# EAGLE design pcb_univ_3-(1-3-5)-x-x-rev4 (EAGLE 5.11)
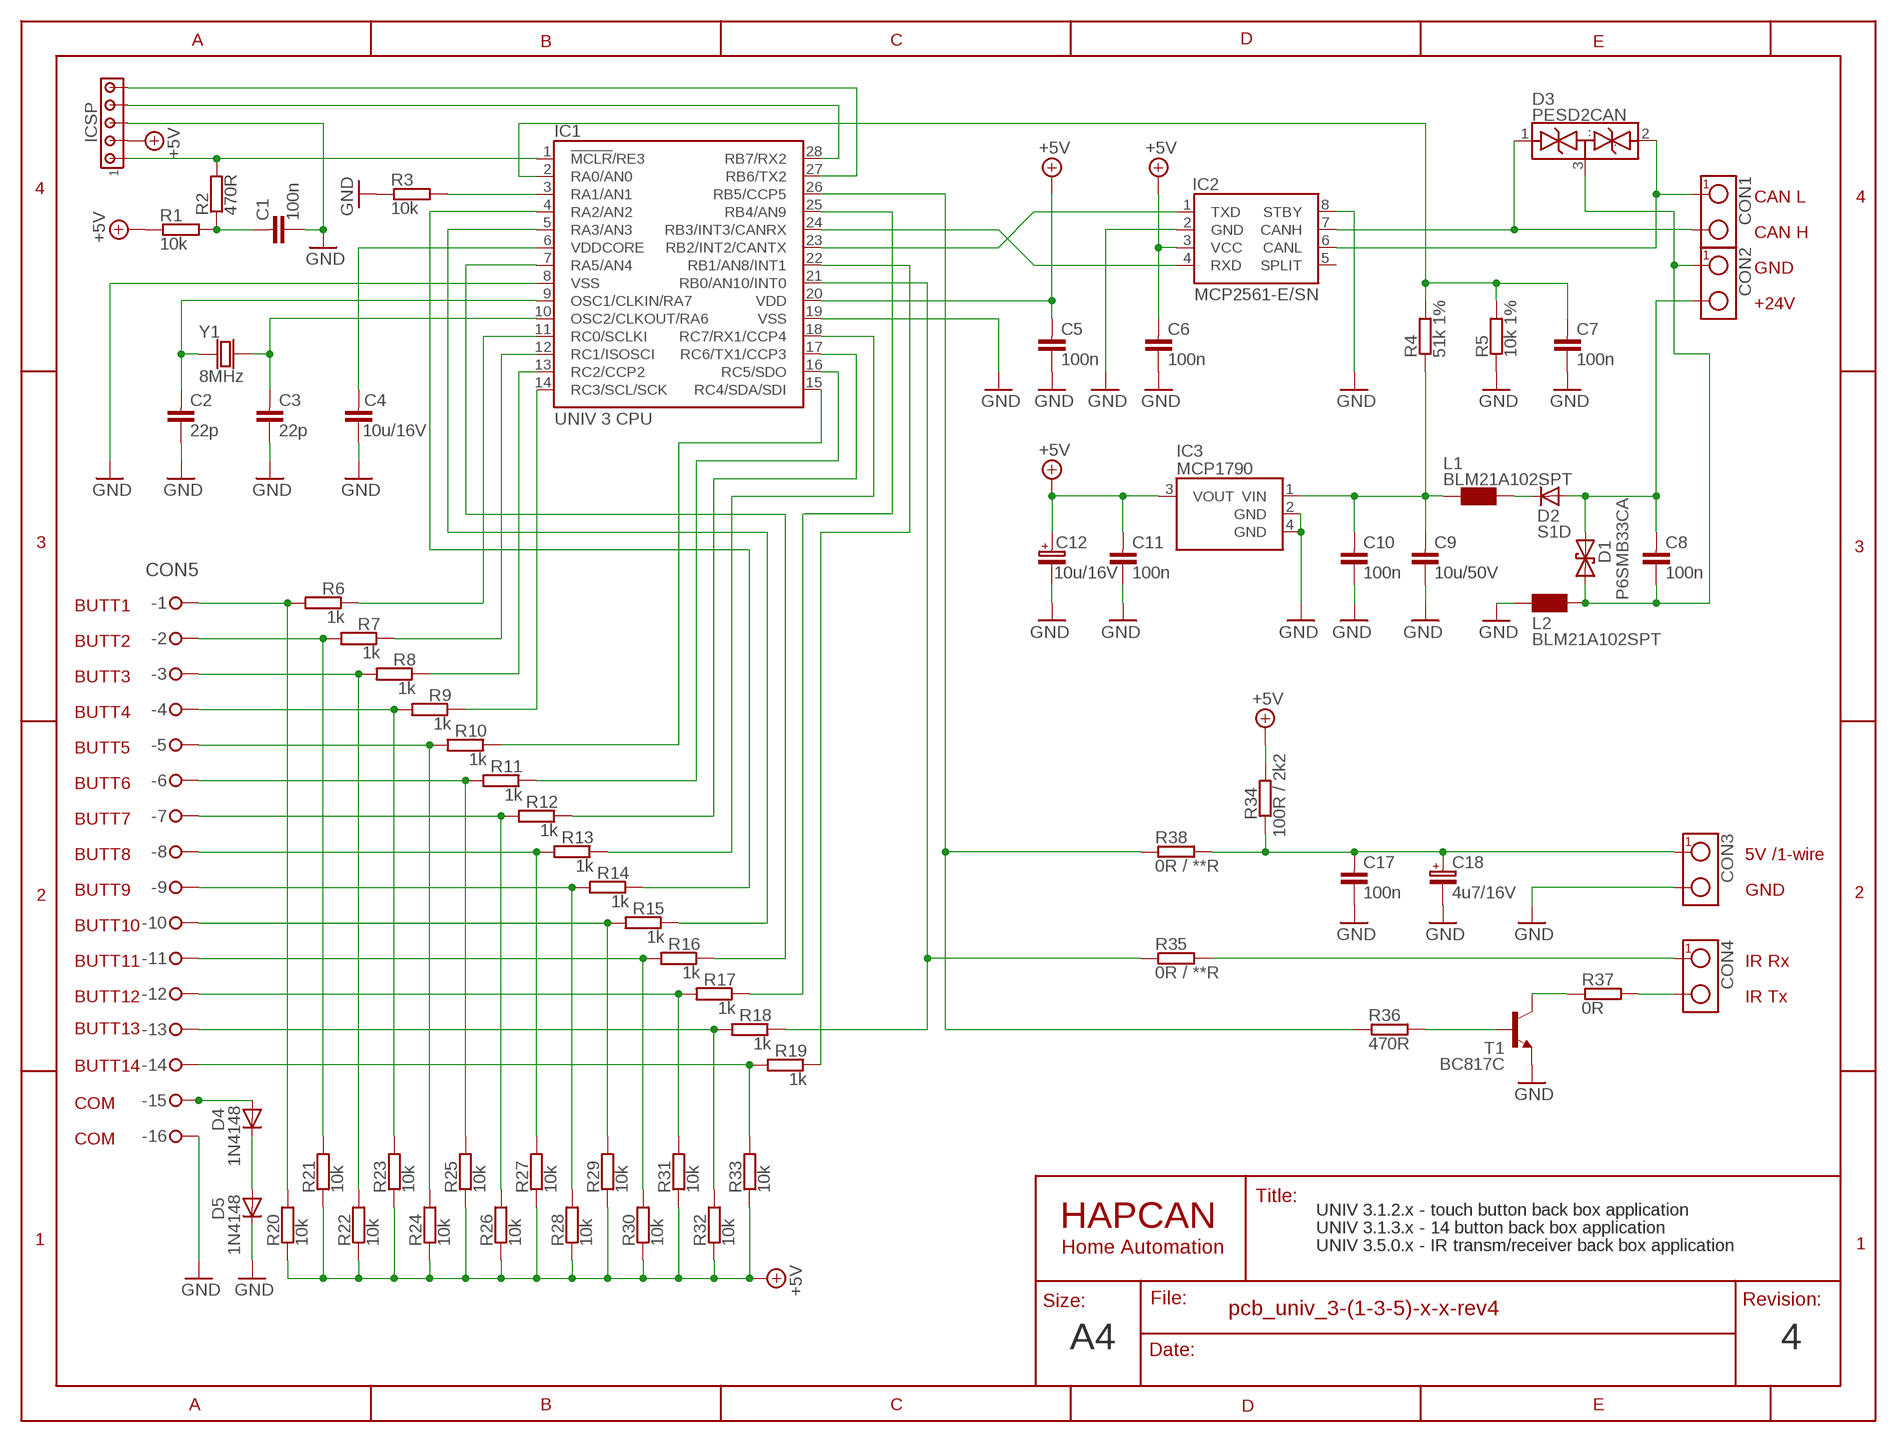
[diagram p0: schematic, sheet 1]

## Parts
-  CONNECTOR-16PIN  [CONNECTOR-16PIN]
C1  100n  CAPACITOR0805  [0805]
C2  22p  CAPACITOR0805  [0805]
C3  22p  CAPACITOR0805  [0805]
C4  10u/16V  CAPACITOR0805  [0805]
C5  100n  CAPACITOR0805  [0805]
C6  100n  CAPACITOR0805  [0805]
C7  100n  CAPACITOR0805  [0805]
C8  100n  CAPACITOR0805  [0805]
C9  10u/50V  CAPACITOR1210  [1210]
C10  100n  CAPACITOR0805  [0805]
C11  100n  CAPACITOR0805  [0805]
C12  10u/16V  CAPACITOR-POLARIZED-SMC_B  [SMC_B]
C17  100n  CAPACITOR0805  [0805]
C18  4u7/16V  CAPACITOR-POLARIZED-SMC_B  [SMC_B]
CON1  TERMINAL-2  TERMINAL-2-5X9MM  [ARK2-5X9MM]
CON2  TERMINAL-2  TERMINAL-2-5X9MM  [ARK2-5X9MM]
CON3  TERMINAL-2  TERMINAL-2-5X9MM  [ARK2-5X9MM]
CON4  TERMINAL-2  TERMINAL-2-5X9MM  [ARK2-5X9MM]
D1  P6SMB33CA  DIODE_TRANSIL2  [DO-214_TRANSIL2]
D2  S1D  DIODE_DO-214  [DO-214]
D3  PESD2CAN  PESD2CANSOT-23  [SOT-23]
D4  1N4148  DIODE_0805  [0805]
D5  1N4148  DIODE_0805  [0805]
IC1  UNIV 3 CPU  UNIV3CPU-I/SO  [UNIV3CPU]
IC2  MCP2561-E/SN  [SO-08]
IC3  MCP1790  [SOT-223]
ICSP  HEADER5  [SIP-5]
L1  BLM21A102SPT  BLMXXX  [0805@1]
L2  BLM21A102SPT  BLMXXX  [0805@1]
R1  10k  RESISTOR0805  [0805]
R2  470R  RESISTOR0805  [0805]
R3  10k  RESISTOR0805  [0805]
R4  51k 1%  RESISTOR0805  [0805]
R5  10k 1%  RESISTOR0805  [0805]
R6  1k  RESISTOR0805  [0805]
R7  1k  RESISTOR0805  [0805]
R8  1k  RESISTOR0805  [0805]
R9  1k  RESISTOR0805  [0805]
R10  1k  RESISTOR0805  [0805]
R11  1k  RESISTOR0805  [0805]
R12  1k  RESISTOR0805  [0805]
R13  1k  RESISTOR0805  [0805]
R14  1k  RESISTOR0805  [0805]
R15  1k  RESISTOR0805  [0805]
R16  1k  RESISTOR0805  [0805]
R17  1k  RESISTOR0805  [0805]
R18  1k  RESISTOR0805  [0805]
R19  1k  RESISTOR0805  [0805]
R20  10k  RESISTOR0805  [0805]
R21  10k  RESISTOR0805  [0805]
R22  10k  RESISTOR0805  [0805]
R23  10k  RESISTOR0805  [0805]
R24  10k  RESISTOR0805  [0805]
R25  10k  RESISTOR0805  [0805]
R26  10k  RESISTOR0805  [0805]
R27  10k  RESISTOR0805  [0805]
R28  10k  RESISTOR0805  [0805]
R29  10k  RESISTOR0805  [0805]
R30  10k  RESISTOR0805  [0805]
R31  10k  RESISTOR0805  [0805]
R32  10k  RESISTOR0805  [0805]
R33  10k  RESISTOR0805  [0805]
R34  100R / 2k2  RESISTOR0805  [0805]
R35  0R / **R  RESISTOR0805  [0805]
R36  470R  RESISTOR0805  [0805]
R37  0R  RESISTOR0805  [0805]
R38  0R / **R  RESISTOR0805  [0805]
T1  BC817C  TRANSISTOR-NPN  [SOT-23]
Y1  8MHz  CRYSTAL-HC49V  [CRYSTAL-HC49V]

## Nets
+5V: C5.1 C6.1 C11.1 C12.+ IC1.20(VDD) IC2.3(VCC) IC3.3(VOUT) ICSP.2 R1.1 R20.1 R21.1 R22.1 R23.1 R24.1 R25.1 R26.1 R27.1 R28.1 R29.1 R30.1 R31.1 R32.1 R33.1 R34.1
GND: -.16 C1.2 C2.2 C3.2 C4.2 C5.2 C6.2 C7.2 C9.2 C10.2 C11.2 C12.- C17.2 C18.- CON3.2 D5.1(C) IC1.8(VSS) IC1.19(VSS) IC2.2(GND) IC2.8(STBY) IC3.2(GND) IC3.4(GND) ICSP.3 L2.1 R3.1 R5.1 T1.2(E)
N$1: IC1.26(RB5/CCP5) R36.1 R38.1
N$2: IC1.24(RB3/INT3/CANRX) IC2.4(RXD)
N$3: IC1.23(RB2/INT2/CANTX) IC2.1(TXD)
N$4: CON4.2 R37.2
N$5: -.1 R6.2 R20.2
N$6: -.3 R8.2 R22.2
N$7: C1.1 R1.2 R2.1
N$8: IC1.1(!MCLR!/RE3) ICSP.1 R2.2
N$9: CON1.2 D3.1(.) IC2.7(CANH)
N$10: IC1.28(RB7/RX2) ICSP.4
N$11: IC1.22(RB1/AN8/INT1) R19.1
N$12: IC1.3(RA1/AN1) R3.2
N$13: -.9 R14.2 R28.2
N$14: IC1.27(RB6/TX2) ICSP.5
N$15: C3.1 IC1.10(OSC2/CLKOUT/RA6) Y1.2
N$16: C7.1 IC1.2(RA0/AN0) R4.2 R5.2
N$17: C9.1 C10.1 IC3.1(VIN) L1.1 R4.1
N$18: IC1.21(RB0/AN10/INT0) R18.1 R35.1
N$19: -.2 R7.2 R21.2
N$20: IC1.25(RB4/AN9) R17.1
N$21: -.4 R9.2 R23.2
N$22: IC1.14(RC3/SCL/SCK) R9.1
N$23: -.6 R11.2 R25.2
N$24: -.7 R12.2 R26.2
N$25: IC1.11(RC0/SCLKI) R6.1
N$26: IC1.12(RC1/ISOSCI) R7.1
N$27: IC1.13(RC2/CCP2) R8.1
N$28: -.10 R15.2 R29.2
N$29: IC1.15(RC4/SDA/SDI) R10.1
N$30: IC1.7(RA5/AN4) R16.1
N$31: -.5 R10.2 R24.2
N$32: -.8 R13.2 R27.2
N$33: IC1.5(RA3/AN3) R15.1
N$34: IC1.4(RA2/AN2) R14.1
N$35: R37.1 T1.3(C)
N$36: -.11 R16.2 R30.2
N$37: C17.1 C18.+ CON3.1 R34.2 R38.2
N$38: -.12 R17.2 R31.2
N$39: C8.2 CON2.1 D1.C D3.3(...) L2.2
N$40: C2.1 IC1.9(OSC1/CLKIN/RA7) Y1.1
N$41: -.14 R19.2 R33.2
N$42: CON1.1 D3.2(..) IC2.6(CANL)
N$43: R36.2 T1.1(B)
N$44: CON4.1 R35.2
N$45: IC1.16(RC5/SDO) R11.1
N$46: IC1.17(RC6/TX1/CCP3) R12.1
N$47: IC1.18(RC7/RX1/CCP4) R13.1
N$48: -.13 R18.2 R32.2
N$49: -.15 D4.2(A)
N$50: D4.1(C) D5.2(A)
N$56: C4.1 IC1.6(VDDCORE)
N$64: C8.1 CON2.2 D1.A D2.A
N$67: D2.C L1.2
Unconnected: IC2.5(SPLIT)

## Notes on the sheet
- CAN L
- CAN H
- GND
- +24V
- CON5
- BUTT1
- BUTT2
- BUTT3
- BUTT4
- BUTT5
- BUTT6
- BUTT7
- BUTT8 | 5V | /1-wire
- BUTT9 | GND
- BUTT10
- BUTT11 | IR Rx
- BUTT12 | IR Tx
- BUTT13
- BUTT14
- COM
- COM
- UNIV 3.1.2.x - touch button back box application
- UNIV 3.1.3.x - 14 button back box application
- UNIV 3.5.0.x - IR transm/receiver back box application
- A4 | 4

## Library data of the parts
- = HAPCAN_devices - UNIV3:CONNECTOR-16PIN: 16pin connector 2.54 raster
C1-C11 C17 = HAPCAN_devices - UNIV3:CAPACITOR: HAPCAN Capacitor
C12 C18 = HAPCAN_devices - UNIV3:CAPACITOR-POLARIZED: HAPCAN Polarazied Capacitor
CON1-CON4 = HAPCAN_devices - UNIV3:TERMINAL-2: HAPCAN Terminal Block - 2 way
D1 = HAPCAN_devices - UNIV3:DIODE_TRANSIL2: HAPCAN Bidirectional transil diode
D2 D4 D5 = HAPCAN_devices - UNIV3:DIODE: HAPCAN Rectifier Diode
D3 = HAPCAN_devices - UNIV3:PESD2CAN: CAN bus ESD protection diode
IC1 = HAPCAN_devices - UNIV3:UNIV3CPU: HAPCAN Microcontroller UNIV 3 CPU
IC2 = HAPCAN_devices - UNIV3:MCP2561: HAPCAN CAN Tranceiver
IC3 = HAPCAN_devices - UNIV3:MCP1790: 70 mA, High Voltage Regulator
ICSP = HAPCAN_devices - UNIV3:HEADER5: HAPCAN Header 5
L1 L2 = HAPCAN_devices - UNIV3:BLMXXX: Choke
R1-R38 = HAPCAN_devices - UNIV3:RESISTOR: HAPCAN Resistor
T1 = HAPCAN_devices - UNIV3:TRANSISTOR-NPN: HAPCAN NPN Transistor
Y1 = HAPCAN_devices - UNIV3:CRYSTAL: HAPCAN Crystal

## Board
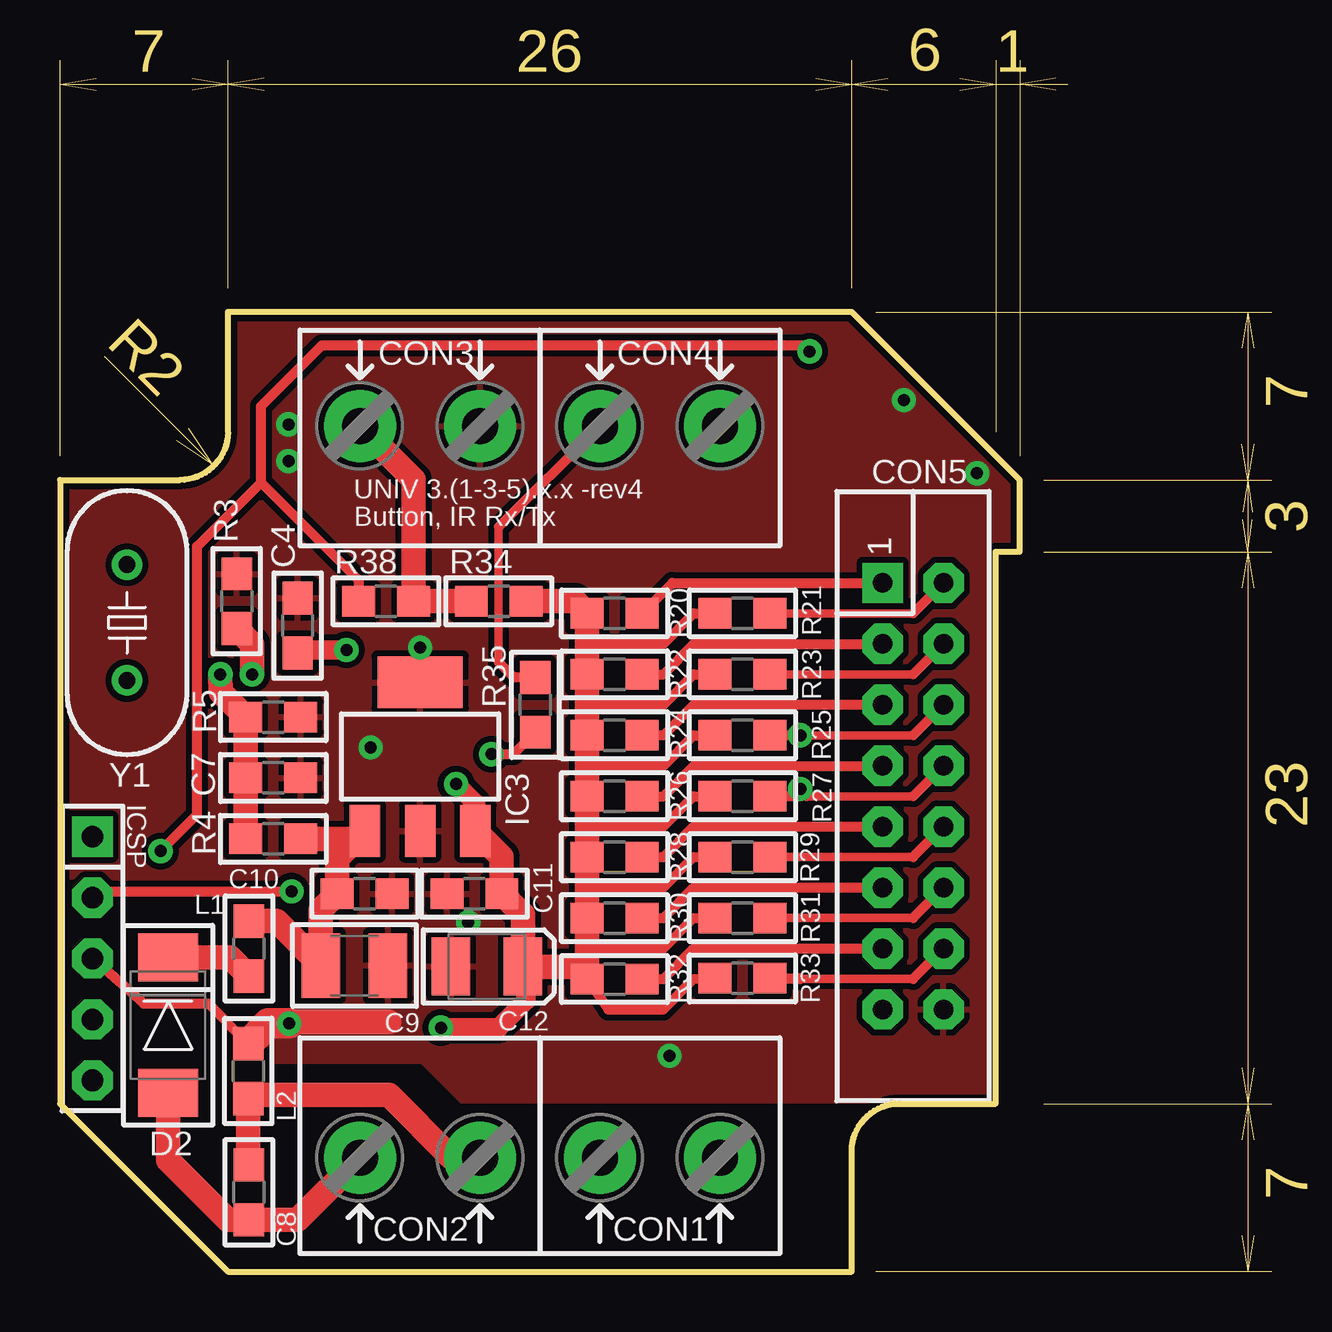
[diagram p1: board, top side]
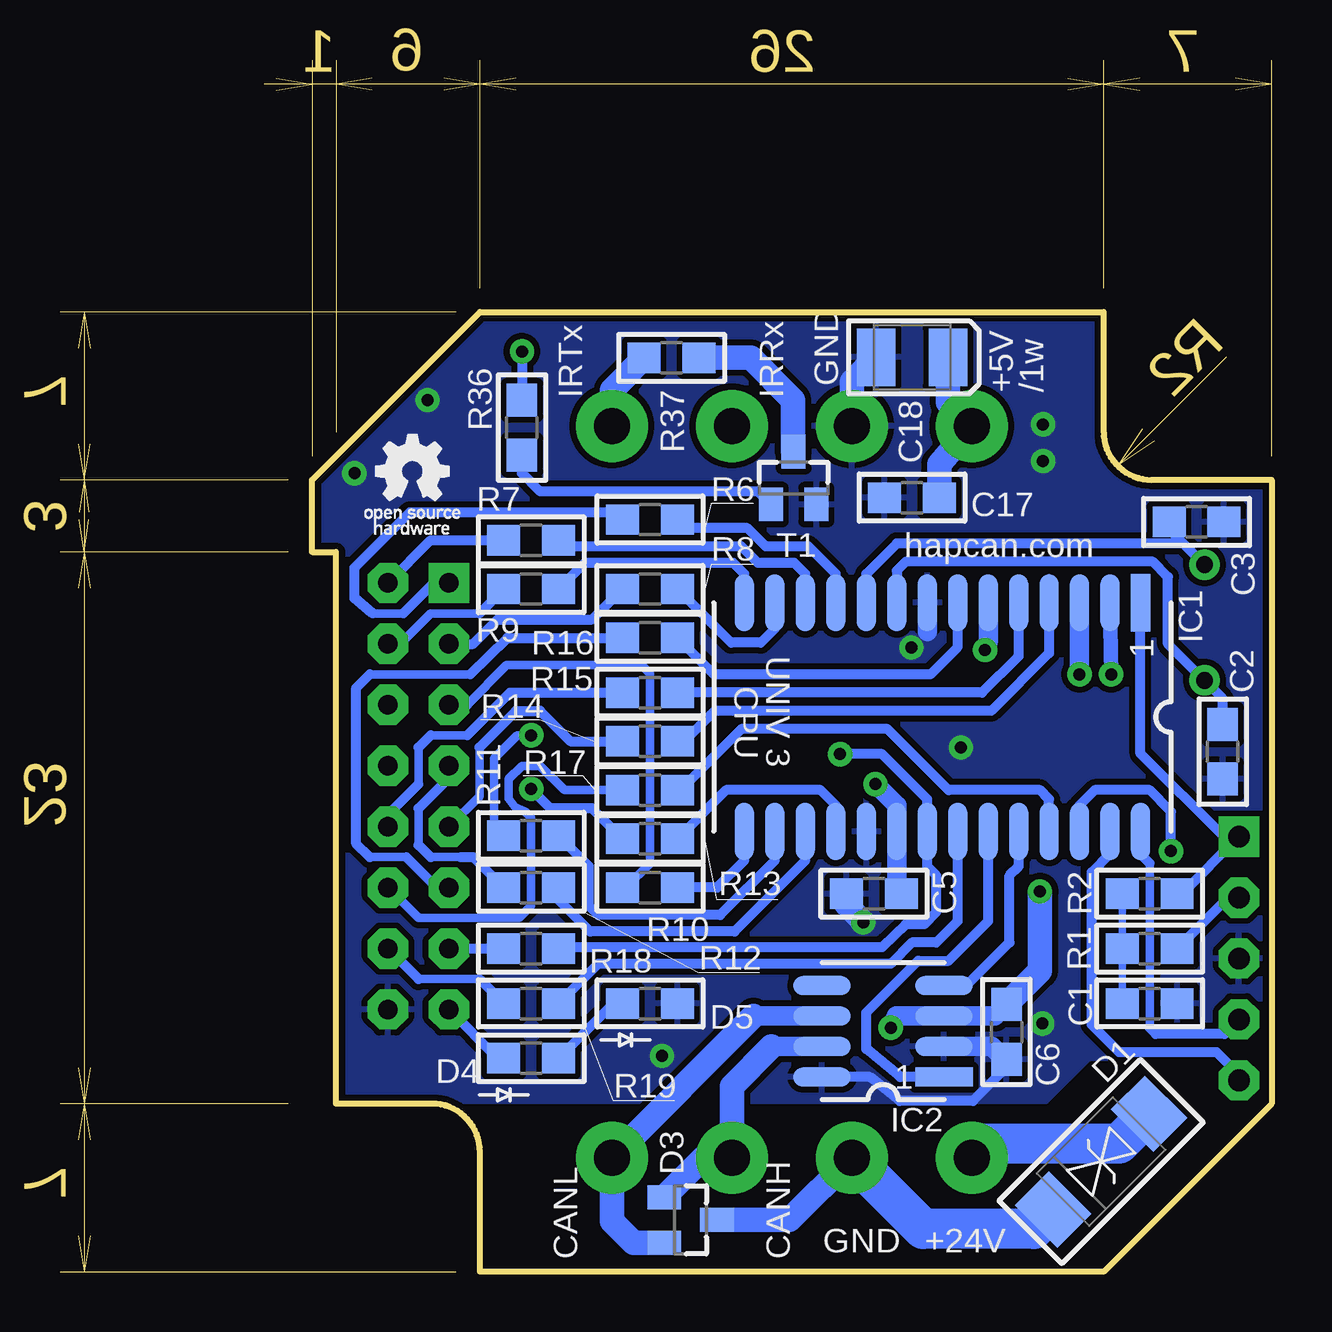
[diagram p2: board, bottom side, seen from below]

Size 50.5 x 50.5 mm. Coordinates in mm from the lower left corner, seen from the top.
Outline: 6.37,33.63 1.86,38.13
Outline: 6.37,33.63 4.87,34.63
Outline: 6.37,33.63 5.37,35.13
Outline: 0,34 0,49.5
Outline: 0,49.5 0,50.5
Outline: 0,49.5 39,49.5
Outline: 39,49.5 40,49.5
Outline: 40,50.5 40,49.5
Outline: 40,49.5 40,34
Outline: 33,41 33,50.5
Outline: 7,41 7,50.5
Outline: 0,49.5 1.5,49.75
Outline: 0,49.5 1.5,49.25
Outline: 8.5,49.75 5.5,49.25
Outline: 5.5,49.75 8.5,49.25
Outline: 31.5,49.25 34.5,49.75
Outline: 31.5,49.75 34.5,49.25
Outline: 34,40 49.5,40
Outline: 49.5,40 50.5,40
Outline: 49.5,40 49.5,33
Outline: 49.5,33 49.5,30
Outline: 49.5,30 49.5,0
Outline: 50.5,0 49.5,0
Outline: 49.5,0 34,0
Outline: 41,7 50.5,7
Outline: 41,33 49.5,33
Outline: 49.5,33 50.5,33
Outline: 49.5,40 49.75,38.5
Outline: 49.5,40 49.25,38.5
Outline: 49.5,33 49.25,34.5
Outline: 49.75,34.5 49.5,33
Outline: 49.25,8.5 49.75,5.5
Outline: 49.75,8.5 49.25,5.5
Outline: 49.25,1.5 49.5,0
Outline: 49.75,1.5 49.5,0
Outline: 41,30 49.5,30
Outline: 49.5,30 50.5,30
Outline: 49.5,30 49.75,28.5
Outline: 49.5,30 49.25,28.5
Outline: 49.5,33 49.3,31.65
Outline: 49.5,33 49.7,31.65
Outline: 49.5,30 49.7,31.35
Outline: 49.5,30 49.3,31.35
Outline: 39,50.5 39,49.5
Outline: 39,49.5 39,35
Outline: 37.5,49.75 39,49.5
Outline: 37.5,49.25 39,49.5
Outline: 40,49.5 42,49.5
Outline: 41.5,49.75 40,49.5
Outline: 41.5,49.25 40,49.5
Outline: 40,30 40,33 33,40 7,40 7,35 arc-90 5,33 0,33 0,7 7,0 33,0 33,5 arc-90 35,7 39,7 39,30 40,30
Copper layers (1*16): Top 0.035mm / dielectric 1.5mm / Bottom 0.035mm
Design rules "hapcan_drc *": minimum track width 10mil, minimum drill 0.5mm, track to track 10mil, track to pad 10mil, pad to pad 10mil, via to via 10mil, smd to smd 0mil, copper to edge 10mil, drill to drill 8mil, minimum pad ring 10mil, minimum via ring 10mil, stop-mask expansion 4mil, vias tented up to drill 0mil, thermal gap 10mil

### Footprints (pad centres in the part's own frame; a part is rotated, then mirrored left to right if it is on the bottom)
CONNECTOR-16PIN = drill 0.813 pad 1.676 square: 1 -8.89,-1.27 | drill 0.813 pad 1.676 octagon: 2 -8.89,1.27; 3 -6.35,-1.27; 4 -6.35,1.27; 5 -3.81,-1.27; 6 -3.81,1.27; 7 -1.27,-1.27; 8 -1.27,1.27; 9 1.27,-1.27; 10 1.27,1.27; 11 3.81,-1.27; 12 3.81,1.27; 13 6.35,-1.27; 14 6.35,1.27; 15 8.89,-1.27; 16 8.89,1.27
0805 = smd 1.372 x 1.27: 1 -1.143,0; 2 1.143,0
1210 = smd 1.6 x 2.7: 1 -1.4,0; 2 1.4,0
SMC_B = smd 1.6 x 2.4: + -1.5,0; - 1.5,0
ARK2-5X9MM = drill 1.5 pad 3 round: 1 -2.5,0; 2 2.5,0
DO-214_TRANSIL2 = smd 2 x 2.5: A 2.82,0; C -2.82,0
DO-214 = smd 2 x 2.5: A 2.82,0; C -2.82,0
SOT-23 = smd 1 x 1.4: 1 -0.95,-1.1; 2 0.95,-1.1; 3 0,1.1
UNIV3CPU = smd 2.4 x 0.8: 1 -4.763,8.255; 2 -4.763,6.985; 3 -4.763,5.715; 4 -4.763,4.445; 5 -4.763,3.175; 6 -4.763,1.905; 7 -4.763,0.635; 8 -4.763,-0.635; 9 -4.763,-1.905; 10 -4.763,-3.175; 11 -4.763,-4.445; 12 -4.763,-5.715; 13 -4.763,-6.985; 14 -4.763,-8.255; 15 4.763,-8.255; 16 4.763,-6.985; 17 4.763,-5.715; 18 4.763,-4.445; 19 4.763,-3.175; 20 4.763,-1.905; 21 4.763,-0.635; 22 4.763,0.635; 23 4.763,1.905; 24 4.763,3.175; 25 4.763,4.445; 26 4.763,5.715; 27 4.763,6.985; 28 4.763,8.255
SO-08 = smd 2.4 x 0.8: 1 -2.54,1.905; 2 -2.54,0.635; 3 -2.54,-0.635; 4 -2.54,-1.905; 5 2.54,-1.905; 6 2.54,-0.635; 7 2.54,0.635; 8 2.54,1.905
SOT-223 = smd 1.27 x 2.159: 1 -2.311,-3.099; 2 0,-3.099; 3 2.311,-3.099 | smd 3.556 x 2.159: 4 0,3.099
SIP-5 = drill 0.9 pad 1.676 square: 1 -5.08,0 | drill 0.9 pad 1.676 octagon: 2 -2.54,0; 3 0,0; 4 2.54,0; 5 5.08,0
0805@1 = smd 1.397 x 1.27: 1 -1.143,0; 2 1.143,0
CRYSTAL-HC49V = drill 0.7 pad 1.27 round: 1 -2.413,0; 2 2.413,0

### Placement (x,y rotation side)
-  35.56,19.81 270 top
C1  5.08,11.18 0 bottom
C2  2.03,21.67 270 bottom
C3  3.12,31.24 0 bottom
C4  9.91,26.92 90 top
C5  16.57,15.75 180 bottom
C6  11.05,9.98 270 bottom
C7  8.89,20.57 0 top
C8  7.87,3.3 90 top
C9  12.27,12.75 0 top
C10  12.7,15.75 0 top
C11  17.27,15.75 180 top
C12  17.79,12.72 180 top
C17  14.99,32.26 180 bottom
C18  14.98,38.11 180 bottom
CON1  25,4.75 180 top
CON2  15,4.75 180 top
CON3  15,35.25 0 top
CON4  25,35.25 0 top
D1  7.1,4.58 45 bottom
D2  4.51,10.27 270 top
D3  24.22,2.15 270 bottom
D4  30.86,8.89 180 bottom
D5  25.91,11.18 180 bottom
IC1  13.72,23.11 270 bottom
IC2  16.19,10.01 180 bottom
IC3  15.01,21.46 0 top
ICSP  1.36,13.05 270 top
L1  7.87,13.46 270 top
L2  7.85,8.36 270 top
R1  5.08,13.46 180 bottom
R2  5.08,15.75 0 bottom
R3  7.37,27.94 270 top
R4  8.89,18.03 180 top
R5  8.89,23.11 180 top
R6  25.91,31.34 180 bottom
R7  30.86,30.48 180 bottom
R8  25.91,28.45 180 bottom
R9  30.86,28.45 180 bottom
R10  25.91,16 180 bottom
R11  30.86,18.16 180 bottom
R12  30.86,16 180 bottom
R13  25.91,18.03 180 bottom
R14  25.91,22.1 180 bottom
R15  25.91,24.13 180 bottom
R16  25.91,26.42 180 bottom
R17  25.91,20.07 180 bottom
R18  30.86,13.46 180 bottom
R19  30.86,11.18 180 bottom
R20  23.11,27.43 0 top
R21  28.45,27.43 0 top
R22  23.11,24.89 0 top
R23  28.45,24.89 0 top
R24  23.11,22.35 0 top
R25  28.45,22.35 0 top
R26  23.11,19.81 0 top
R27  28.45,19.81 0 top
R28  23.11,17.27 0 top
R29  28.45,17.27 0 top
R30  23.11,14.73 0 top
R31  28.45,14.73 0 top
R32  23.11,12.19 0 top
R33  28.45,12.22 0 top
R34  18.29,27.94 180 top
R35  19.81,23.62 90 top
R36  31.24,35.18 270 bottom
R37  25.01,38.08 180 bottom
R38  13.59,27.94 0 top
T1  19.92,33.08 0 bottom
Y1  2.79,27.05 90 top

### Tracks (layer width: path | path; a pad name or v marks a point on that pad's centre or on a via)
+5V  (via drill 0.5, 0.5 pad 1.02)
  Top 0.406: R21.1 26.42,27.43 25.15,26.16 21.97,26.16 | R23.1 26.42,24.89 25.15,23.62 21.97,23.62 | R25.1 26.42,22.35 25.15,21.08 21.97,21.08 | R27.1 26.42,19.81 25.15,18.54 21.97,18.54 | R29.1 26.42,17.27 25.15,16 21.97,16 | R31.1 26.42,14.73 25.15,13.46 21.97,13.46 | R33.1 26.42,12.19 25.15,10.92 22.86,10.92 R32.1 | 9.49,15.84 v9.65,15.85 1.62,15.85 ICSP.2
  Top 0.813: v15.88,10.16 18.29,10.16 19.43,11.3 19.43,12.7 C12.+ | IC3.3 17.32,19.51 v16.51,20.32
  Top 1.016: C12.+ 19.29,14.89 C11.1 18.41,17.27 IC3.3 | R34.1 21.46,27.94 R20.1 21.97,26.16 R22.1 21.97,23.62 R24.1 21.97,21.08 R26.1 21.97,18.54 R28.1 21.97,16 R30.1 21.97,13.46 R32.1 21.97,12.7 19.43,12.7
  Bottom 0.406: 15.62,15.74 C5.1 | R1.1 1.81,15.59 ICSP.2
  Bottom 0.813: 15.62,15.74 IC1.20 15.62,19.43 v16.51,20.32 | v15.88,10.16 15.64,10.65 IC2.3 11.53,10.65 C6.1
  Bottom 1.016: C6.1 9.65,12.52 v9.65,15.85
GND  (via drill 0.5, 0.5 pad 0.81, 0.5 pad 1.02)
  Top 0.406: ICSP.3 3.48,11.18 6.17,11.18 L2.1
  Top 1.016: C12.- 16.36,12.75 | v15.01,26.01 | v9.55,10.34 9.91,10.41 13.72,10.41
  Top 1.27: L2.1 8.69,10.34 v9.55,10.34
  Bottom 0.406: IC1.19 16.89,19.18 | IC2.8 16.75,8.11 15.49,7.11 12.45,7.11 10.92,8.64
  Bottom 0.813: IC1.8 14.35,26.67 | 10.92,8.64 11.66,9.38 IC2.2
  Bottom 1.016: CON3.2 17.5,37.09 C18.- | v17.02,14.55 17.71,15.3 C5.2
  other vias: 9.53,35.31 9.53,33.78 12.95,21.84 25.4,8.99 38.23,33.27 35.18,36.32
  pour Top (isolate 0.254): 7,40 33,40 40,33 40,30 39,30 39,7.11 16.76,7.11 15.11,8.76 8.41,8.76 8.43,10 10,11.02 10.08,15 0,15.21 0,33 6,33 7,34
  pour Bottom: 7,40 33,40 40,33 40,30 39,30 39,8 39.01,7.11 9.4,7.11 7.62,8.89 0,9.02 0,33 6,33 7,34
N$1  (via drill 0.5 pad 1.02)
  Top 0.406: 8.38,32.89 5.71,30.23 5.71,19.05 v4.19,17.53 | 8.38,32.89 8.38,36.07 10.92,38.61 30.98,38.61 v31.24,38.35 | 8.38,32.89 12.45,28.83 R38.1
  Bottom 0.406: IC1.26 8,19.43 7.37,20.07 5.08,20.07 4.19,19.18 v4.19,17.53 | v31.24,38.35 R36.1
N$2
  Bottom 0.406: IC2.4 13.23,11.92 | IC2.4 13.48,11.92 | IC1.24 10.54,16.89 10.92,16.51 10.92,13.72 12.72,11.92 IC2.4
N$3
  Bottom 0.406: IC2.1 15.47,8.11 16.89,9.27 16.89,10.79 14.73,12.95 13.46,12.95 11.81,14.61 IC1.23
N$4
  Bottom 1.016: R37.2 27.5,36.73 CON4.2
N$5
  Top 0.406: R20.2 25.53,28.7 -.1
  Bottom 0.356: 36.2,27.43 37.47,27.43
  Bottom 0.406: 37.47,27.43 38.23,28.07 38.23,29.34 35.92,31.65 27.36,31.65 R6.2 | 36.2,27.43 34.92,28.7 -.1
N$6
  Top 0.406: R22.2 25.15,24.89 26.42,26.16 -.3
  Bottom 0.406: R8.2 28.32,27.18 32.26,27.18 33.27,26.16 -.3
N$7
  Bottom 0.305: R2.1 R1.2 C1.1
N$8
  Bottom 0.406: IC1.1 5.46,21.59 2,18.13 ICSP.1 3.74,15.75 R2.2
N$9
  Bottom 0.813: 20.85,9.38 IC2.7
  Bottom 1.016: D3.1 23.67,4.75 CON1.2 22.5,7.73 20.85,9.38
N$10
  Bottom 0.356: 5.08,10.16 5.08,17.02
  Bottom 0.406: 5.46,17.4 IC1.28 | 5.46,17.4 5.33,17.53 | 5.08,10.16 4.83,9.91 1.96,9.91 ICSP.4 | 5.08,17.02 5.46,17.4
N$11
  Bottom 0.406: R19.1 28.07,12.83 15.88,12.83 14.99,13.72 13.97,13.72 13.08,14.61 IC1.22
N$12  (via drill 0.5)
  Top 1.016: v8,24.89 8,26.16 R3.2
  Bottom 0.813: v8,24.89 IC1.3
N$13
  Top 0.406: R28.2 25.15,17.27 26.42,18.54 -.9
  Bottom 0.356: 33.02,21.84 33.02,19.81 -.9
  Bottom 0.406: 33.02,21.84 31.5,23.37 30.48,23.37 29.21,22.1 R14.2
N$14
  Bottom 0.406: IC1.27 6.73,17.4 7.49,16.64 7.49,10.29 6.35,9.14 2.28,9.14 1.36,8.22 ICSP.5
N$15
  Bottom 0.406: Y1.2 2.81,29.59 | IC1.10 16.89,29.08 15.62,30.35 3.68,30.35 Y1.2 | C3.1 4.01,30.68 Y1.2
N$16  (via drill 0.5 pad 1.02)
  Top 1.016: R4.2 C7.1 R5.2 6.71,24.16 v6.68,24.89
  Bottom 0.61: v6.68,24.89 IC1.2
N$17
  Top 1.016: R4.1 12.37,18.03 arc90 IC3.1 11.56,17.22 C10.1 10.87,15.06 C9.1 9.02,14.61 L1.1
N$18  (via drill 0.5 pad 1.02)
  Top 0.406: R35.1 18.9,21.57 v17.98,21.57
  Bottom 0.406: v17.98,21.57 16.23,21.57 14.35,19.68 IC1.21 14.35,16.89 13.97,16.51 13.97,14.99 14.48,14.48 15.24,14.48 16.23,13.51 29.67,13.51 R18.1
N$19
  Top 0.356: R21.2 35.56,27.43
  Top 0.406: 35.56,27.43 -.2
  Bottom 0.406: 32.13,30.1 R7.2 35.05,30.48 -.2
N$20
  Bottom 0.406: IC1.25 9.27,19.68 9.65,20.07 13.46,20.07 16,22.61 22.1,22.61 24.38,20.32 R17.1
N$21
  Top 0.356: R23.2 35.56,24.89
  Top 0.406: 35.56,24.89 -.4
  Bottom 0.356: 36.32,26.16 35.05,27.43 33.02,27.43
  Bottom 0.406: -.4 36.32,26.16 | 33.02,27.43 R9.2
N$22
  Bottom 0.406: IC1.14 21.97,29.08 22.43,29.54 28.63,29.54 R9.1
N$23  (via drill 0.5 pad 1.02)
  Top 0.356: v30.86,22.35 35.56,22.35
  Top 0.406: 35.56,22.35 -.6 | v30.86,22.35 R25.2
  Bottom 0.356: 32.41,18.16 32.41,21.39 31.45,22.35 v30.86,22.35
  Bottom 0.406: R11.2 32.41,18.16
N$24
  Top 0.406: R26.2 25.15,19.81 26.42,21.08 -.7
  Bottom 0.356: 35.05,17.27 33.78,17.27 | 35.56,19.3 35.56,17.78
  Bottom 0.406: 35.56,17.78 35.05,17.27 | 35.56,19.3 34.29,20.57 -.7 | 33.78,17.27 33.27,17.27 R12.2
N$25
  Bottom 0.406: IC1.11 18.16,29.08 19.3,30.23 21.08,30.23 21.84,30.99 24.41,30.99 R6.1
N$26
  Bottom 0.406: IC1.12 19.43,29.08 19.89,29.54 21.41,29.54 22.1,30.23 29.46,30.23 R7.1
N$27
  Bottom 0.406: IC1.13 20.7,26.8 21.29,26.21 22.53,26.21 R8.1
N$28
  Top 0.356: R29.2 35.56,17.27
  Top 0.406: 35.56,17.27 -.10
  Bottom 0.356: 35.05,22.35 33.53,22.35 | 35.56,20.32 35.56,21.84
  Bottom 0.406: 35.56,21.84 35.05,22.35 | 35.56,20.32 36.83,19.05 -.10 | R15.2 31.75,24.13 33.53,22.35
N$29
  Bottom 0.406: IC1.15 21.97,17.14 23.11,16 R10.1
N$30
  Bottom 0.406: IC1.7 13.08,26.04 14.22,24.89 23.24,24.89 R16.1
N$31
  Top 0.406: R24.2 25.15,22.35 26.42,23.62 -.5
  Bottom 0.356: 26.92,16 25.91,17.02 25.91,24.92 26.26,25.27 31.88,25.27 33.53,23.62
  Bottom 0.406: R10.2 26.92,16 | 33.53,23.62 -.5
N$32  (via drill 0.5 pad 1.02)
  Top 0.356: 31.11,19.81 35.56,19.81
  Top 0.406: 35.56,19.81 -.8 | R27.2 30.61,19.81 v30.86,20.12 31.11,19.81
  Bottom 0.406: v30.86,20.12 30.05,19.3 28.32,19.3 R13.2
N$33
  Bottom 0.406: IC1.5 10.54,25.65 12.06,24.13 R15.1
N$34
  Bottom 0.406: IC1.4 9.27,25.78 11.68,23.37 23.22,23.37 24.49,22.1 R14.1
N$35
  Bottom 1.016: T1.3 19.94,34.19 19.94,36.32 21.7,38.08 R37.1
N$36
  Top 0.406: R30.2 25.15,14.73 26.42,16 -.11
  Bottom 0.356: 36.07,17.27 37.59,17.27 | 37.59,24.89 33.4,24.89
  Bottom 0.406: 37.59,24.89 38.15,24.33 38.15,17.83 37.59,17.27 | 36.07,17.27 34.8,16 -.11 | R16.2 31.85,26.42 33.4,24.89
N$37
  Top 1.016: R34.2 R38.2 14.73,33.02 CON3.1
  Bottom 1.016: C18.+ 13.48,36.23 CON3.1 13.84,33.66 C17.1
N$38
  Top 0.356: R31.2 35.56,14.73
  Top 0.406: 35.56,14.73 -.12
  Bottom 0.356: -.12 35.56,14.73 31.37,14.73 30.86,15.24 30.86,18.92 31.11,19.18 31.55,19.38 31.8,19.71 31.8,20.52 31.24,21.08 30.48,21.08 29.46,20.07 R17.2
N$39
  Top 1.016: C8.2 7.85,5.23 L2.2 7.85,7.37 13.72,7.37 16.33,4.75 CON2.1
  Bottom 1.016: D3.3 20.1,2.15 CON2.1
  Bottom 1.676: CON2.1 14.53,1.78 9.91,1.78 D1.C
N$40
  Bottom 0.406: IC1.9 15.62,29.21 15.24,29.59 4.95,29.59 4.32,28.96 4.32,26.16 Y1.1 2.03,23.88 C2.1
N$41
  Top 0.356: 30.86,12.19 35.56,12.19
  Top 0.406: 35.56,12.19 -.14 | 30.86,12.19 30.83,12.22 R33.2
  Bottom 0.356: 35.56,12.19 33.02,12.19
  Bottom 0.406: -.14 35.56,12.19 | 33.02,12.19 R19.2
N$42
  Bottom 0.813: 21.6,10.65 IC2.6
  Bottom 1.016: 21.6,10.65 CON1.1 27.5,2.1 26.6,1.2 D3.2
N$43
  Bottom 0.406: R36.2 31.24,33.27 30.48,32.51 21.41,32.51 T1.1
N$44
  Top 0.356: 18.29,25.4 18.29,31.04
  Top 0.406: R35.2 18.92,24.77 18.29,25.4 | 18.29,31.04 CON4.1
N$45
  Bottom 0.406: R11.1 28.45,16.89 28.45,15.24 28.07,14.86 22.99,14.86 20.7,17.14 IC1.16
N$46
  Bottom 0.356: 29.72,15.49 R12.1 | 19.43,17.14 IC1.17
  Bottom 0.406: 29.72,15.49 28.4,14.17 22.38,14.17 19.43,17.14
N$47
  Bottom 0.406: IC1.18 18.16,19.43 18.8,20.07 22.73,20.07 R13.1
N$48
  Top 0.406: R32.2 25.15,12.19 26.42,13.46 -.13
  Bottom 0.406: -.13 R18.2
N$49
  Bottom 0.406: -.15 32.26,8.89 D4.2
N$50
  Bottom 0.406: D4.1 27.43,11.18 D5.2
N$56  (via drill 0.5 pad 1.02)
  Top 0.813: C4.1 10.16,25.9 v11.94,25.91
  Bottom 0.813: IC1.6 11.81,26.29 v11.94,25.91
N$64
  Top 1.016: CON2.2 9.91,2.16 C8.1 6.99,2.16 4.51,4.64 D2.A
  Bottom 1.676: CON2.2 11.92,5.33 6.35,5.33 D1.A | D1.A
N$67
  Top 1.016: L1.2 7.1,13.09 D2.C

### Text on the board
Dimension: 7 | 26 | 6 | 1 | R2 | 7 | 3 | 23 | 7
tNames: CON5 | UNIV 3.(1-3-5).x.x -rev4 | Button, IR Rx/Tx
bNames: /1w | +5V | GND | IRRx | IRTx | hapcan.com | +24V | GND | CANH | CANL